# Altium schematic sheet Sheet_CL-STM32.SchDoc: STM32F407
size A3; Author: Canaan Lv; DocumentNumber: CL-STM32; Revision: v3.0; PageSetup: Record=PageOptions|CenterHorizontal=True|CenterVertical=True|PrintScale=1.00|XCorrection=1.00|YCorrection=1.00|PrintKind=1|BorderSize=5000000|LeftOffset=0|BottomOffset=0|Orientation=2|PaperLength=1000|PaperWidth=1000|Scale=100|PaperSource=7|PrintQuality=-3|MediaType=1|DitherType=10|PrintScaleMode=1|PaperKind=B5 (JIS)|PaperIndex=13
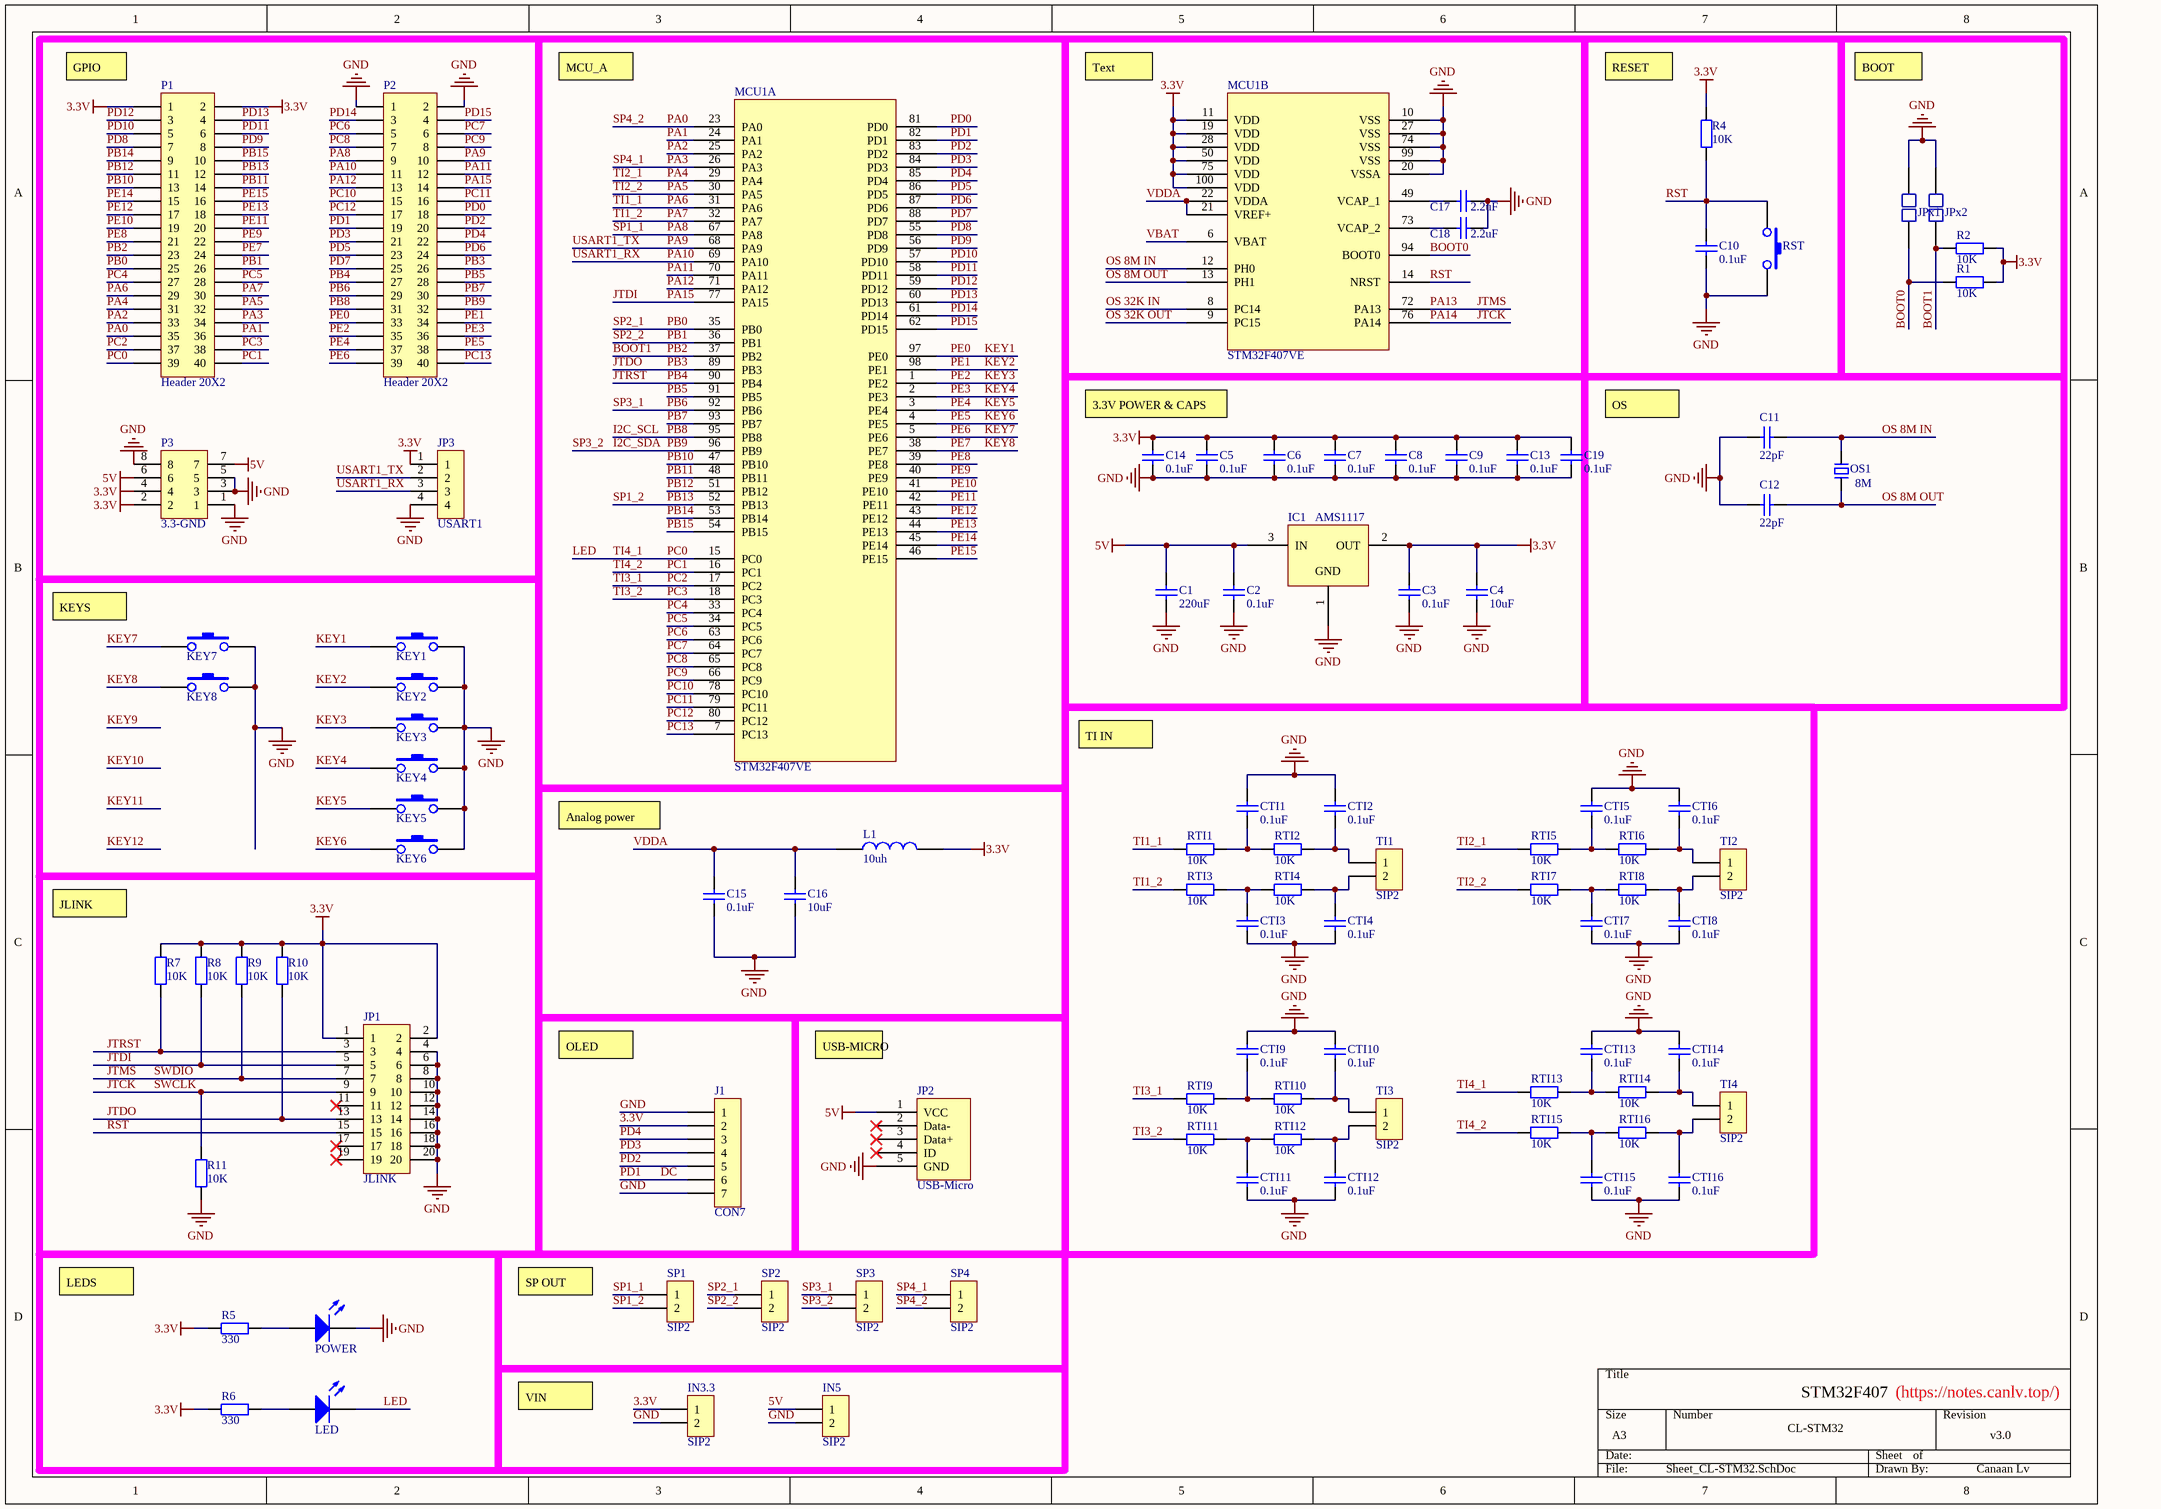
[diagram p0: Sheet_CL-STM32.SchDoc]

## Parts
C1  220uF  [0805]
C2  0.1uF  [0603]
C3  0.1uF  [0603]
C4  10uF  [0603]
C5  0.1uF  [0603]
C6  0.1uF  [0603]
C7  0.1uF  [0603]
C8  0.1uF  [0603]
C9  0.1uF  [0603]
C10  0.1uF  [0603]
C11  22pF  [0603]
C12  22pF  [0603]
C13  0.1uF  [0603]
C14  0.1uF  [0603]
C15  0.1uF  [0603]
C16  10uF  [0603]
C17  2.2uF  [0603]
C18  2.2uF  [0603]
C19  0.1uF  [0603]
CTI1  0.1uF  [0603]
CTI2  0.1uF  [0603]
CTI3  0.1uF  [0603]
CTI4  0.1uF  [0603]
CTI5  0.1uF  [0603]
CTI6  0.1uF  [0603]
CTI7  0.1uF  [0603]
CTI8  0.1uF  [0603]
CTI9  0.1uF  [0603]
CTI10  0.1uF  [0603]
CTI11  0.1uF  [0603]
CTI12  0.1uF  [0603]
CTI13  0.1uF  [0603]
CTI14  0.1uF  [0603]
CTI15  0.1uF  [0603]
CTI16  0.1uF  [0603]
IC1  AMS1117  [AMS1117]
IN3.3  SIP2  [2.54XH接插件2P]
IN5  SIP2  [2.54XH接插件2P]
J1  CON7  [2.54排针1X7]
JP1  JLINK  [2.54简易牛角座20p]
JP2  USB-Micro  [USB-MICRO贴片]
JP3  USART1  [2.54排针1X4]
JPx1  Select  [选择焊点-0402]  (value not drawn)
JPx2  Select  [选择焊点-0402]  (value not drawn)
KEY1  按键  [SWT6*3]  (value not drawn)
KEY2  按键  [SWT6*3]  (value not drawn)
KEY3  按键  [SWT6*3]  (value not drawn)
KEY4  按键  [SWT6*3]  (value not drawn)
KEY5  按键  [SWT6*3]  (value not drawn)
KEY6  按键  [SWT6*3]  (value not drawn)
KEY7  按键  [SWT6*3]  (value not drawn)
KEY8  按键  [SWT6*3]  (value not drawn)
L1  10uh  [0603-res]
LED  LED  [D0603]  (value not drawn)
MCU1  STM32F407VE  [F-QFP14x14-G100/P.5N]  (parts A,B of 2)
OS1  (no value)  [HC-49S]
P1  Header 20X2  [2.54排针2X20]
P2  Header 20X2  [2.54排针2X20]
P3  3.3-GND  [2.54排针2X4]
POWER  LED  [D0603]  (value not drawn)
R1  10K  [0603-res]
R2  10K  [0603-res]
R4  10K  [0603-res]
R5  330  [0603-res]
R6  330  [0603-res]
R7  10K  [0603-res]
R8  10K  [0603-res]
R9  10K  [0603-res]
R10  10K  [0603-res]
R11  10K  [0603-res]
RST  按键  [按键微动开关2]  (value not drawn)
RTI1  10K  [0603-res]
RTI2  10K  [0603-res]
RTI3  10K  [0603-res]
RTI4  10K  [0603-res]
RTI5  10K  [0603-res]
RTI6  10K  [0603-res]
RTI7  10K  [0603-res]
RTI8  10K  [0603-res]
RTI9  10K  [0603-res]
RTI10  10K  [0603-res]
RTI11  10K  [0603-res]
RTI12  10K  [0603-res]
RTI13  10K  [0603-res]
RTI14  10K  [0603-res]
RTI15  10K  [0603-res]
RTI16  10K  [0603-res]
SP1  SIP2  [2.54XH接插件2P]
SP2  SIP2  [2.54XH接插件2P]
SP3  SIP2  [2.54XH接插件2P]
SP4  SIP2  [2.54XH接插件2P]
TI1  SIP2  [2.54XH接插件2P]
TI2  SIP2  [2.54XH接插件2P]
TI3  SIP2  [2.54XH接插件2P]
TI4  SIP2  [2.54XH接插件2P]

## Nets
3.3V: C3.2 C4.2 C5.2 C6.2 C7.2 C8.2 C9.2 C13.2 C14.2 C19.2 IC1.2(OUT) IN3.3.1 J1.2 JP1.1 JP1.2 JP3.1 L1.2 MCU1.11(VDD) MCU1.19(VDD) MCU1.28(VDD) MCU1.50(VDD) MCU1.75(VDD) MCU1.100(VDD) P1.1 P1.2 P3.2 P3.4 R1.1 R2.1 R4.2 R5.1 R6.1 R7.2 R8.2 R9.2 R10.2
5V: C1.2 C2.2 IC1.3(IN) IN5.1 JP2.1(VCC) P3.6 P3.7
GND: C1.1 C2.1 C3.1 C4.1 C5.1 C6.1 C7.1 C8.1 C9.1 C10.1 C11.2 C12.2 C13.1 C14.1 C15.1 C16.1 C17.2 C18.2 C19.1 CTI1.2 CTI2.2 CTI3.1 CTI4.1 CTI5.2 CTI6.2 CTI7.1 CTI8.1 CTI9.2 CTI10.2 CTI11.1 CTI12.1 CTI13.2 CTI14.2 CTI15.1 CTI16.1 IC1.1(GND) IN3.3.2 IN5.2 J1.1 J1.7 JP1.4 JP1.6 JP1.8 JP1.10 JP1.12 JP1.14 JP1.16 JP1.18 JP1.20 JP2.5(GND) JP3.4 JPx1.2 JPx2.2 KEY1.2 KEY2.2 KEY3.2 KEY4.2 KEY5.2 KEY6.2 KEY7.2 KEY8.2 MCU1.10(VSS) MCU1.20(VSSA) MCU1.27(VSS) MCU1.74(VSS) MCU1.99(VSS) P2.1 P2.2 P3.1 P3.3 P3.5 P3.8 POWER.2(K) R11.1 RST.2
BOOT0: JPx1.1 MCU1.94(BOOT0) R1.2
BOOT1: JPx2.1 MCU1.37(PB2) P1.23 R2.2  [also labelled PB2]
DC: J1.6 MCU1.82(PD1) P2.19  [also labelled PD1]
I2C_SCL: MCU1.95(PB8) P2.31  [also labelled PB8]
I2C_SDA: MCU1.96(PB9) P2.32 SP3.2  [also labelled PB9, SP3_2]
JTCK: JP1.9 MCU1.76(PA14) R11.2  [also labelled PA14, SWCLK]
JTDI: JP1.5 MCU1.77(PA15) P2.14 R8.1  [also labelled PA15]
JTDO: JP1.13 MCU1.89(PB3) P2.26 R10.1  [also labelled PB3]
JTMS: JP1.7 MCU1.72(PA13) R9.1  [also labelled PA13, SWDIO]
JTRST: JP1.3 MCU1.90(PB4) P2.27 R7.1  [also labelled PB4]
KEY1: KEY1.1 MCU1.97(PE0) P2.33  [also labelled PE0]
KEY2: KEY2.1 MCU1.98(PE1) P2.34  [also labelled PE1]
KEY3: KEY3.1 MCU1.1(PE2) P2.35  [also labelled PE2]
KEY4: KEY4.1 MCU1.2(PE3) P2.36  [also labelled PE3]
KEY5: KEY5.1 MCU1.3(PE4) P2.37  [also labelled PE4]
KEY6: KEY6.1 MCU1.4(PE5) P2.38  [also labelled PE5]
KEY7: KEY7.1 MCU1.5(PE6) P2.39  [also labelled PE6]
KEY8: KEY8.1 MCU1.38(PE7) P1.24  [also labelled PE7]
LED: LED.2(K) MCU1.15(PC0) P1.39 RTI13.1  [also labelled PC0, TI4_1]
OS 8M IN: C11.1 MCU1.12(PH0) OS1.2
OS 8M OUT: C12.1 MCU1.13(PH1) OS1.1
OS 32K IN: MCU1.8(PC14)
OS 32K OUT: MCU1.9(PC15)
PA0: MCU1.23(PA0) P1.35 SP4.2  [also labelled SP4_2]
PA1: MCU1.24(PA1) P1.36
PA2: MCU1.25(PA2) P1.33
PA3: MCU1.26(PA3) P1.34 SP4.1  [also labelled SP4_1]
PA4: MCU1.29(PA4) P1.31 RTI5.1  [also labelled TI2_1]
PA5: MCU1.30(PA5) P1.32 RTI7.1  [also labelled TI2_2]
PA6: MCU1.31(PA6) P1.29 RTI1.1  [also labelled TI1_1]
PA7: MCU1.32(PA7) P1.30 RTI3.1  [also labelled TI1_2]
PA8: MCU1.67(PA8) P2.9 SP1.1  [also labelled SP1_1]
PA9: JP3.2 MCU1.68(PA9) P2.10  [also labelled USART1_TX]
PA10: JP3.3 MCU1.69(PA10) P2.11  [also labelled USART1_RX]
PA11: MCU1.70(PA11) P2.12
PA12: MCU1.71(PA12) P2.13
PB0: MCU1.35(PB0) P1.25 SP2.1  [also labelled SP2_1]
PB1: MCU1.36(PB1) P1.26 SP2.2  [also labelled SP2_2]
PB5: MCU1.91(PB5) P2.28
PB6: MCU1.92(PB6) P2.29 SP3.1  [also labelled SP3_1]
PB7: MCU1.93(PB7) P2.30
PB10: MCU1.47(PB10) P1.13
PB11: MCU1.48(PB11) P1.14
PB12: MCU1.51(PB12) P1.11
PB13: MCU1.52(PB13) P1.12 SP1.2  [also labelled SP1_2]
PB14: MCU1.53(PB14) P1.9
PB15: MCU1.54(PB15) P1.10
PC1: MCU1.16(PC1) P1.40 RTI15.1  [also labelled TI4_2]
PC2: MCU1.17(PC2) P1.37 RTI9.1  [also labelled TI3_1]
PC3: MCU1.18(PC3) P1.38 RTI11.1  [also labelled TI3_2]
PC4: MCU1.33(PC4) P1.27
PC5: MCU1.34(PC5) P1.28
PC6: MCU1.63(PC6) P2.5
PC7: MCU1.64(PC7) P2.6
PC8: MCU1.65(PC8) P2.7
PC9: MCU1.66(PC9) P2.8
PC10: MCU1.78(PC10) P2.15
PC11: MCU1.79(PC11) P2.16
PC12: MCU1.80(PC12) P2.17
PC13: MCU1.7(PC13) P2.40
PD0: MCU1.81(PD0) P2.18
PD2: J1.5 MCU1.83(PD2) P2.20
PD3: J1.4 MCU1.84(PD3) P2.21
PD4: J1.3 MCU1.85(PD4) P2.22
PD5: MCU1.86(PD5) P2.23
PD6: MCU1.87(PD6) P2.24
PD7: MCU1.88(PD7) P2.25
PD8: MCU1.55(PD8) P1.7
PD9: MCU1.56(PD9) P1.8
PD10: MCU1.57(PD10) P1.5
PD11: MCU1.58(PD11) P1.6
PD12: MCU1.59(PD12) P1.3
PD13: MCU1.60(PD13) P1.4
PD14: MCU1.61(PD14) P2.3
PD15: MCU1.62(PD15) P2.4
PE8: MCU1.39(PE8) P1.21
PE9: MCU1.40(PE9) P1.22
PE10: MCU1.41(PE10) P1.19
PE11: MCU1.42(PE11) P1.20
PE12: MCU1.43(PE12) P1.17
PE13: MCU1.44(PE13) P1.18
PE14: MCU1.45(PE14) P1.15
PE15: MCU1.46(PE15) P1.16
RST: C10.2 JP1.15 MCU1.14(NRST) R4.1 RST.1
VBAT: MCU1.6(VBAT)
VDDA: C15.2 C16.2 L1.1 MCU1.21(VREF+) MCU1.22(VDDA)
NetC17_1: C17.1 MCU1.49(VCAP_1)
NetC18_1: C18.1 MCU1.73(VCAP_2)
NetCTI1_1: CTI1.1 RTI1.2 RTI2.1
NetCTI2_1: CTI2.1 RTI2.2 TI1.1
NetCTI3_2: CTI3.2 RTI3.2 RTI4.1
NetCTI4_2: CTI4.2 RTI4.2 TI1.2
NetCTI5_1: CTI5.1 RTI5.2 RTI6.1
NetCTI6_1: CTI6.1 RTI6.2 TI2.1
NetCTI7_2: CTI7.2 RTI7.2 RTI8.1
NetCTI8_2: CTI8.2 RTI8.2 TI2.2
NetCTI9_1: CTI9.1 RTI9.2 RTI10.1
NetCTI10_1: CTI10.1 RTI10.2 TI3.1
NetCTI11_2: CTI11.2 RTI11.2 RTI12.1
NetCTI12_2: CTI12.2 RTI12.2 TI3.2
NetCTI13_1: CTI13.1 RTI13.2 RTI14.1
NetCTI14_1: CTI14.1 RTI14.2 TI4.1
NetCTI15_2: CTI15.2 RTI15.2 RTI16.1
NetCTI16_2: CTI16.2 RTI16.2 TI4.2
NetLED_1: LED.1(A) R6.2
NetPOWER_1: POWER.1(A) R5.2

Not connected (* = marked no-connect by the designer): JP1 11* 17* 19*; JP2 2(Data-)* 3(Data+)* 4(ID)*

## Notes on the sheet
- (near P1) GPIO
- MCU_A
- Text
- (near R4) RESET
- BOOT
- 3.3V POWER & CAPS
- (near C19) OS
- KEYS
- TI IN
- Analog power
- (near R7) JLINK
- OLED
- USB-MICRO
- LEDS
- SP OUT
- (https://notes.canlv.top/)
- VIN
- (in symbol JT) 8M

## Library data of the parts
C1-C19 CTI1-CTI16 = Cap1
  C1: value: 220uF
  C2 C3 C5-C10 C13-C15 C19 CTI1-CTI16: value: 0.1uF
  C4 C16: value: 10uF
  C11 C12: value: 22pF
  C17 C18: value: 2.2uF
IC1 = CJA1117
IN3.3 IN5 SP1-SP4 TI1-TI4 = SIP2: jointbar
J1 = CON7: Connector
JP1 = PIN-20
JP3 = SIP-4
L1 = 电感
OS1 = JT
P1 P2 = Header 20X2: Header, 20-Pin, Dual row; LatestRevisionDate: 17-Jul-2002; LatestRevisionNote: Re-released for DXP Platform.; Publisher: Altium Limited
P3 = PIN-8
R1 R2 R4-R11 RTI1-RTI16 = Res
  R1 R2 R4 R7-R11 RTI1-RTI16: value: 10K
  R5 R6: value: 330